# Altium schematic sheet AD9364_RF.SchDoc: AD9364_RF
size A3; DrawnBy: Omar_Lopez; Engineer: Omar_Lopez; DocumentNumber: 6; SheetNumber: 6; SheetTotal: 7; PageSetup: Record=PageOptions|CenterHorizontal=True|CenterVertical=True|PrintScale=0.51|XCorrection=1.00|YCorrection=1.00|PrintKind=1|BorderSize=5000000|LeftOffset=0|BottomOffset=0|Orientation=2|PaperLength=1000|PaperWidth=1000|Scale=100|PaperSource=7|PrintQuality=-3|MediaType=1|DitherType=10|PrintScaleMode=1|PaperKind=A3|PaperIndex=8; ModifiedDate: 17/08/2018
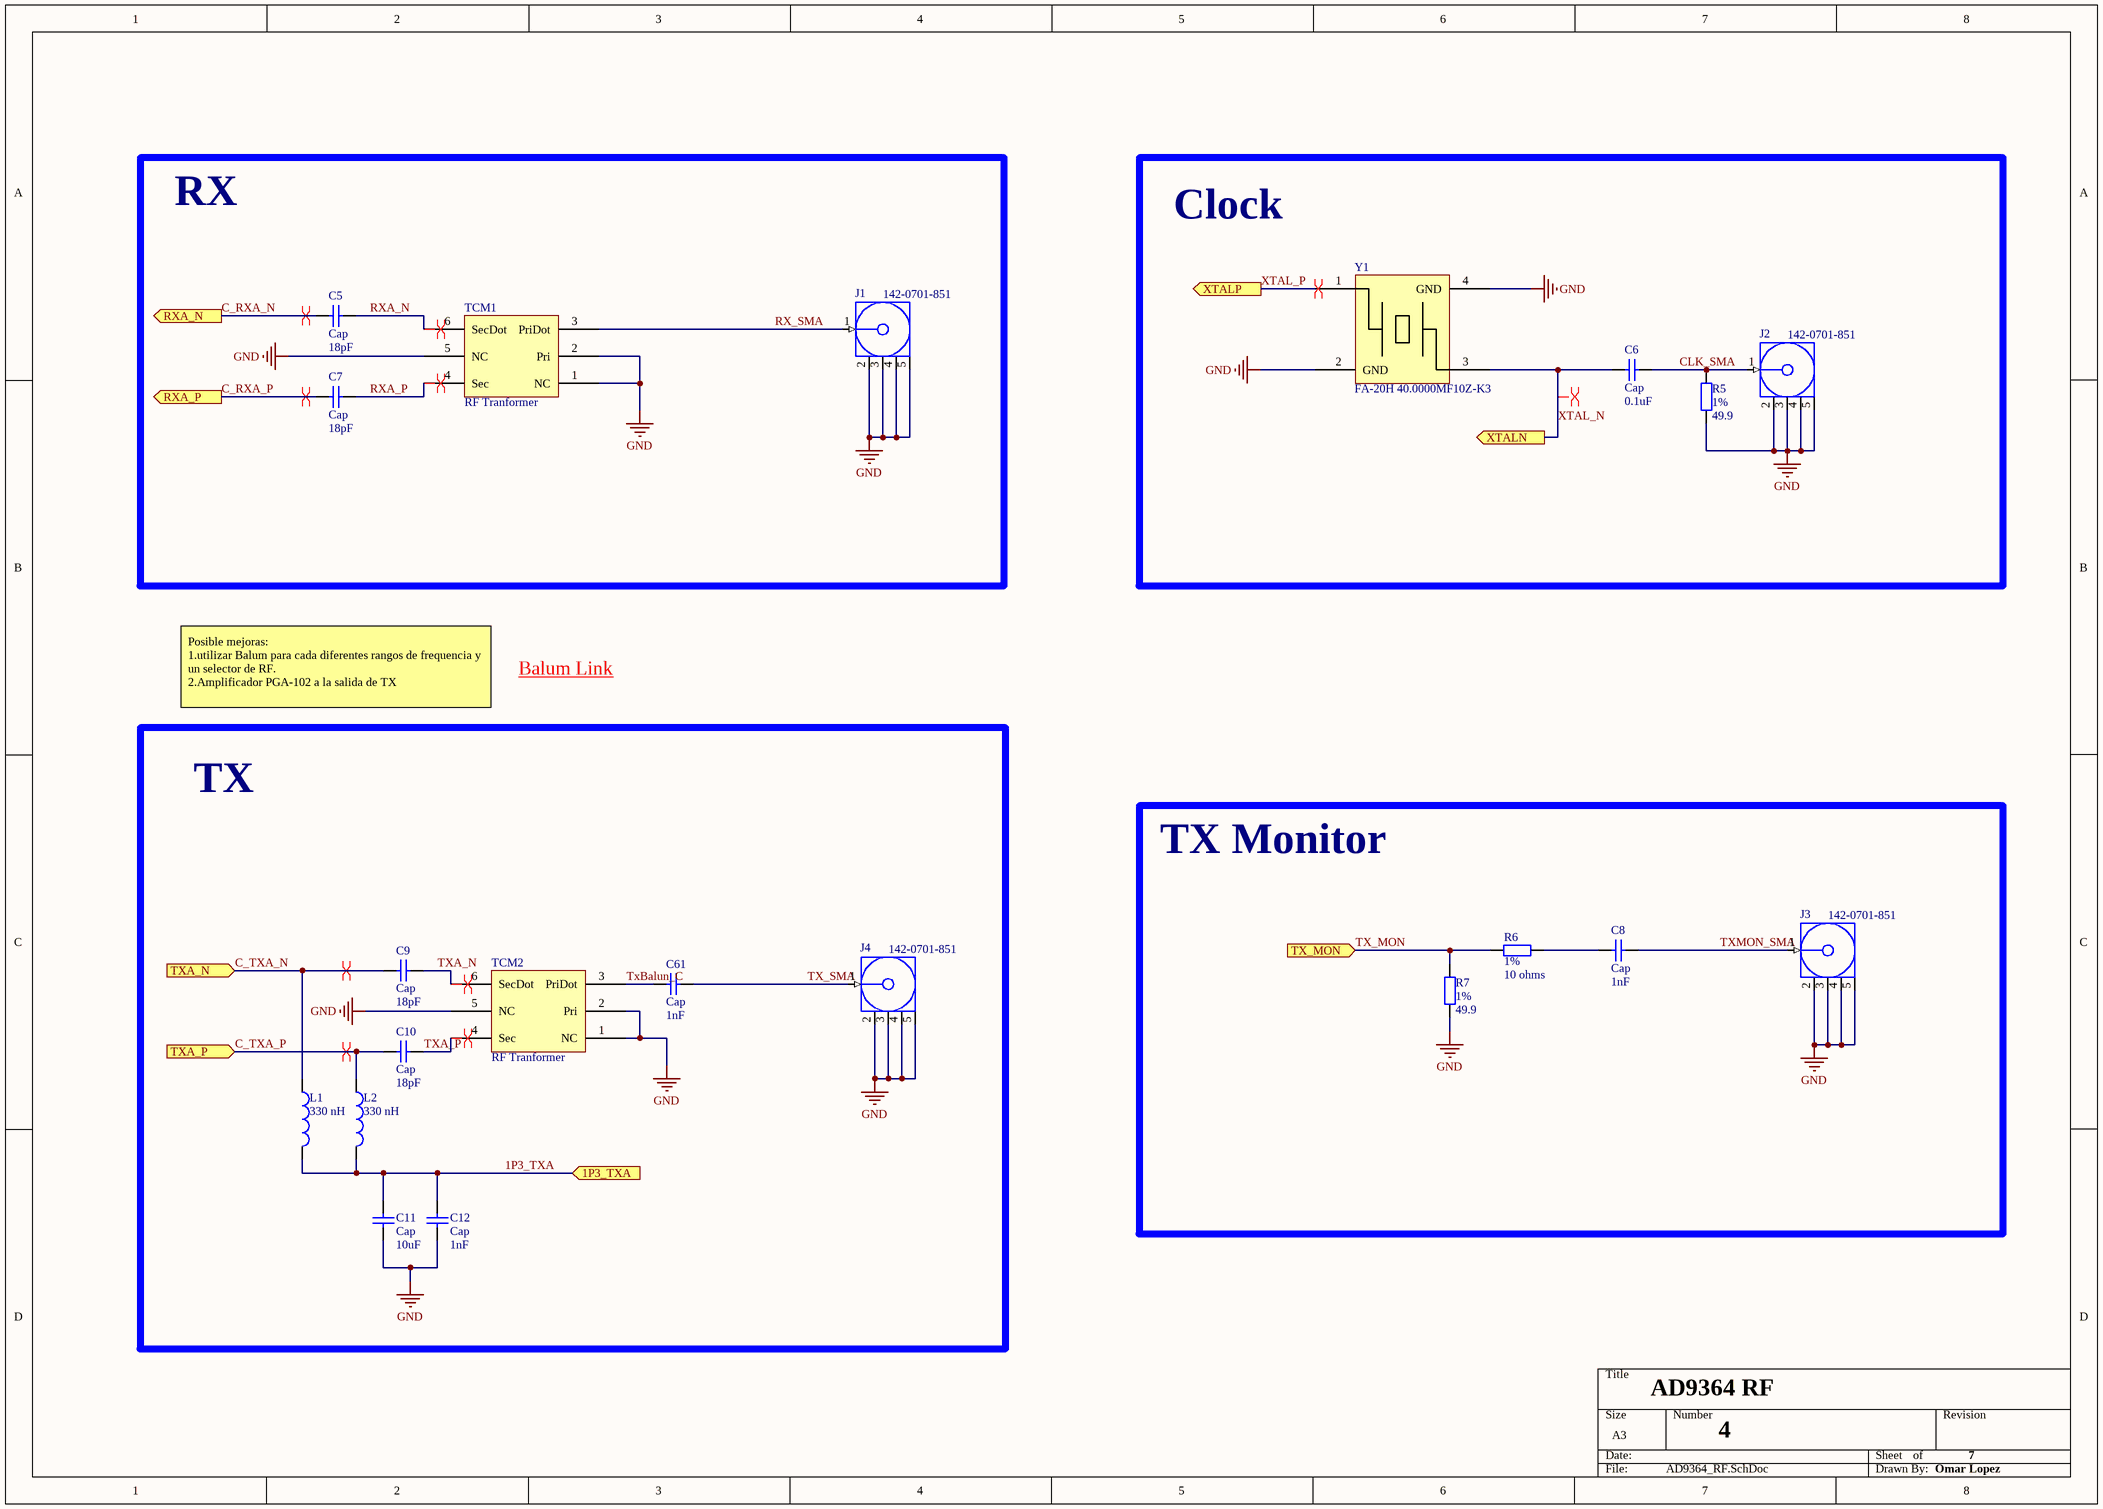
[diagram p0: AD9364_RF.SchDoc]

## Parts
C5  Cap  value 18pF  [GRM0402MurataCap]
C6  Cap  value 0.1uF  [GRM0603MurataCap]
C7  Cap  value 18pF  [GRM0402MurataCap]
C8  Cap  value 1nF  [GRM0402MurataCap]
C9  Cap  value 18pF  [GRM0402MurataCap]
C10  Cap  value 18pF  [GRM0402MurataCap]
C11  Cap  value 10uF  [GRM0603MurataCap]
C12  Cap  value 1nF  [GRM0402MurataCap]
C61  Cap  value 1nF  [GRM0402MurataCap]
J1  142-0701-851  [J502-ND-142-0701-851/861]
J2  142-0701-851  [J502-ND-142-0701-851/861]
J3  142-0701-851  [J502-ND-142-0701-851/861]
J4  142-0701-851  [J502-ND-142-0701-851/861]
L1  value 330 nH  [B82498F3331J]  (hidden comment: B82498F3331J)
L2  value 330 nH  [B82498F3331J]  (hidden comment: B82498F3331J)
R5  1%  value 49.9  [RC0402N]
R6  1%  value 10 ohms  [RC0402N]
R7  1%  value 49.9  [RC0402N]
TCM1  RF Tranformer  [TCM]
TCM2  RF Tranformer  [TCM]
Y1  FA-20H 40.0000MF10Z-K3  [FA-20H]

## Blocks framed on the sheet
RX: C5 C7 J1 TCM1
Clock: C6 J2 R5 Y1
TX: C9-C12 C61 J4 L1 L2 TCM2
TX Monitor: C8 J3 R6 R7

## Ports
1P3_TXA (in), RXA_N (out), RXA_P (out), TX_MON (in), TXA_N (in), TXA_P (in), XTALN (out), XTALP (out)

## Nets
GND: C11.1 C12.2 J1.2(GND) J1.3(GND) J1.4(GND) J1.5(GND) J2.2(GND) J2.3(GND) J2.4(GND) J2.5(GND) J3.2(GND) J3.3(GND) J3.4(GND) J3.5(GND) J4.2(GND) J4.3(GND) J4.4(GND) J4.5(GND) R5.1 R7.1 TCM1.1(NC) TCM1.2(Pri) TCM1.5(NC) TCM2.1(NC) TCM2.2(Pri) TCM2.5(NC) Y1.2(GND) Y1.4(GND)
1P3_TXA: C11.2 C12.1 L1.2 L2.2 ; port 1P3_TXA
C_RXA_N: C5.2 ; port RXA_N
C_RXA_P: C7.2 ; port RXA_P
C_TXA_N: C9.2 L1.1 ; port TXA_N
C_TXA_P: C10.2 L2.1 ; port TXA_P
CLK_SMA: C6.2 J2.1(Signal) R5.2
RX_SMA: J1.1(Signal) TCM1.3(PriDot)
RXA_N: C5.1 TCM1.6(SecDot)
RXA_P: C7.1 TCM1.4(Sec)
TX_MON: R6.2 R7.2 ; port TX_MON
TX_SMA: C61.2 J4.1(Signal)
TXA_N: C9.1 TCM2.6(SecDot)
TXA_P: C10.1 TCM2.4(Sec)
TxBalun_C: C61.1 TCM2.3(PriDot)
TXMON_SMA: C8.2 J3.1(Signal)
XTAL_N: C6.1 Y1.3 ; port XTALN
XTAL_P: Y1.1 ; port XTALP
NetC8_1: C8.1 R6.1

## Layout directives
differential pair; net class RF_Diff100: C_RXA_N, C_RXA_P, C_TXA_N, C_TXA_P, RXA_N, RXA_P, TXA_N, TXA_P, XTAL_N, XTAL_P

## Notes on the sheet
- Posible mejoras:
  1.utilizar Balum para cada diferentes rangos de frequencia y un selector de RF.
  2.Amplificador PGA-102 a la salida de TX
- Balum Link <https://wiki.analog.com/resources/eval/user-guides/ad-fmcomms2-ebz/hardware/configuration_options>
- AD9364 RF
- 4
- 7
- Omar Lopez

## Library data of the parts
C5 C7 C9 C10 = Cap: Capacitor; Manufacturer: Murata; PartNumber: GJM0225C1C180JB01L; Tolerance: 5%; Descripción: Capacitores cerámicos de capas múltiples (MLCC) - SMD/SMT 01005 18pF 16volts C0G +/-5%; CostoVendedor1: 0.14; Vendedor1: Mouser; Vendedor2: Digi-Key; Package: 0402; DataSheet: http://www.mouser.com/ds/2/281/c03e-806517.pdf; LinkVendedor1: https://ar.mouser.com/ProductDetail/Murata-Electronics/GJM0225C1C180JB01L?qs=sGAEpiMZZMs0AnBnWHyRQP81ohtk65EYWMl1VXotSbI%3d; Stock1: 68000
C6 = Cap: Capacitor; Manufacturer: Murata; PartNumber: GRM188R71E104JA01D; Tolerance: 5%; Descripción: SMD/SMT 0603 0.1uF 25volts X7R 5%; CostoVendedor2: 0.15; Vendedor1: Mouser; Vendedor2: Digi-Key; Package: 0603; DataSheet: http://www.mouser.com/ds/2/281/c02e-2905.pdf; LinkVendedor2: https://www.digikey.com/product-detail/en/murata-electronics-north-america/GRM188R71E104JA01D/490-9732-2-ND/2612492; Stock2: 30000
C8 C12 C61 = Cap: Capacitor; Manufacturer: Murata; PartNumber: GRM1555C1H102FA01D; Tolerance: 10%; Descripción: 50V SMD; CostoVendedor1: 0.25; Vendedor1: Mouser; Vendedor2: Digi-Key; Package: 0402; DataSheet: http://www.mouser.com/ds/2/281/c02e-2905.pdf; LinkVendedor1: https://ar.mouser.com/ProductDetail/Murata-Electronics/GRM1555C1H102FA01D?qs=sGAEpiMZZMs0AnBnWHyRQHS%2f3XE0oMwxlJflngdMc0Y%3d; Stock1: 95000
C11 = Cap: Capacitor; Manufacturer: Murata; PartNumber: GRT188R60G106ME13D; Tolerance: 20%; Descripción: SMD/SMT 1608 25Vdc 10uF X5R 20%; CostoVendedor1: 0.49; Vendedor1: Mouser; Vendedor2: Digi-Key; Package: 0603; DataSheet: http://www.mouser.com/ds/2/281/product-794208.pdf; LinkVendedor1: https://ar.mouser.com/ProductDetail/Murata-Electronics/GRT188R60G106ME13D?qs=sGAEpiMZZMs0AnBnWHyRQKtaB%2fEehnE2FeWHGxzsCN63uIWHwhnbHA%3d%3d; Stock1: 11000
J1 = COAX-F: RF Coaxial PCB Connector, MCX; Thru-Hole, Right-Angle Mount Socket, Blunt Post Terminal, 50 Ohm Impedance; Manufacturer: Johnson / Cinch Connectivity Solutions; Descripción: Conectores RF / Conectores coaxiales PC END MT JCK GLD .062 BOARDS TAB; CostoVendedor1: 5.52; Vendedor1: Mouser; Vendedor2: Digi-Key; DataSheet: https://ar.mouser.com/datasheet/2/643/pi-CCS-JOHN-142-0701-851-1290383.pdf; PartNumber: 142-0701-851; LinkVendedor1: https://ar.mouser.com/ProductDetail/Johnson-Cinch-Connectivity-Solutions/142-0701-851?qs=%2fha2pyFadui1v%252bStuw7JbeUEiJG3TyXX5bGPyZB9EpM%252bWw6GQwzJRg%3d%3d; Stock1: 17000
J2-J4 = COAX-F: RF Coaxial PCB Connector, MCX; Thru-Hole, Right-Angle Mount Socket, Blunt Post Terminal, 50 Ohm Impedance; Vendedor1: Mouser; Vendedor2: Digi-Key
L1 L2 = Inductor: Manufacturer: TDK; Descripción: Inductores fijos 330nH 220mA 5% 2.3x1.7mm SMD; CostoVendedor1: 0.81; Vendedor1: Mouser; Vendedor2: Digi-Key; DataSheet: http://www.mouser.com/ds/2/400/b82498f-596539.pdf; Package: 0805; PartNumber: B82498F3331J; LinkVendedor1: https://ar.mouser.com/ProductDetail/EPCOS-TDK/B82498F3331J?qs=sGAEpiMZZMsg%252by3WlYCkUwkmiFJnoZ0di2L4sEIoqKU%3d; Stock1: 8000
R5 R7 = Res2: Resistor; Manufacturer: Panasonic; PartNumber: ERJ-2RKF49R9X; Descripción: 100mw 50V; CostoVendedor1: 0.021; Vendedor1: Mouser; Vendedor2: Digi-Key; Package: 0402; Tolerance: 1%; DataSheet: http://www.mouser.com/ds/2/315/AOA0000C86-911473.pdf; LinkVendedor1: https://ar.mouser.com/ProductDetail/Panasonic-Industrial-Devices/ERJ-2RKF49R9X?qs=%2fha2pyFadujciewGcSbxYMVpd936K1irgOtSxB%2fFXkKqb8tQ1uQ2Cg%3d%3d; Stock1: 800000
R6 = Res2: Resistor; Manufacturer: Panasonic; PartNumber: ERJ-2RKF10R0X; Descripción: 100mw 50V; CostoVendedor1: 0.021; Vendedor1: Mouser; Vendedor2: Digi-Key; Package: 0402; Tolerance: 1%; DataSheet: http://www.mouser.com/ds/2/315/AOA0000C86-911473.pdf; LinkVendedor1: https://ar.mouser.com/ProductDetail/Panasonic-Industrial-Devices/ERJ-2RKF10R0X?qs=sGAEpiMZZMu61qfTUdNhGzRxdwze5h8Zlk5qBe8JEKw%3d; Stock1: 500000
TCM1 TCM2 = TCM163AX: Manufacturer: Mini-Circuits; PartNumber: TCM1-63AX+; CostoVendedor1: 6.95; DataSheet: https://www.minicircuits.com/WebStore/dashboard.html?model=TCM1-63AX%2B; Descripción: RF Tranformer; LinkVendedor1: https://www.minicircuits.com/WebStore/dashboard.html?model=TCM1-63AX%2B; LinkVendedor2: https://www.minicircuits.com/WebStore/dashboard.html?model=TCM1-63AX%2B; Vendedor1: Mini-Circuits; Vendedor2: Mini-Circuits
  TCM2: CostoVendedor2: 6.95
Y1 = Component_1: Crystal; Manufacturer: Epson; Descripción: Cristales 40MHz 10ppm 10pF -20C +75C; CostoVendedor1: 0.73; Vendedor1: Mouser; Vendedor2: Digi-Key; DataSheet: http://www.mouser.com/ds/2/137/A-20H_en-932938.pdf; PartNumber: FA-20H 40.0000MF10Z-K3; LinkVendedor1: https://ar.mouser.com/ProductDetail/Epson-Timing/FA-20H-400000MF10Z-K3?qs=%2fha2pyFadujuEaJmRI34tlQPzQojZDIPOS1ANIFqpboCpjGmZ0XFoEeTXimjZ5yU; Stock1: 1000